# EAGLE schematic air_quality (EAGLE 6.5.0)
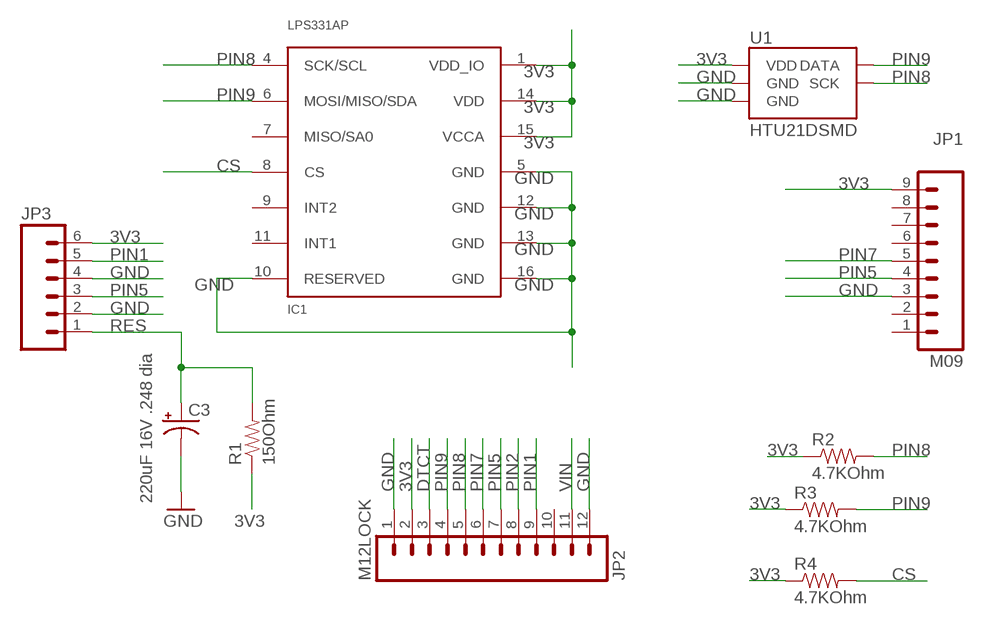
[diagram p0: schematic, sheet 1]

## Parts
C3  220uF 16V .248 dia  CPOL-US153CLV-0605  [153CLV-0605]
IC1  LPS331AP  [HCLGA-16L]
JP1  M09  [1X09]
JP2  M12LOCK  [1X12_LOCK]
JP3  M06LOCK  [1X06_LOCK]
R1  150Ohm  RESISTOR0402-RES  [0402-RES]
R2  4.7KOhm  RESISTOR0402-RES  [0402-RES]
R3  4.7KOhm  RESISTOR0402-RES  [0402-RES]
R4  4.7KOhm  RESISTOR0402-RES  [0402-RES]
U1  HTU21DSMD  [HTU21D]

## Nets
3V3: IC1.1(VDD_IO) IC1.14(VDD) IC1.15(VCCA) JP1.9 JP2.2 JP3.6 R1.1 R2.1 R3.1 R4.1 U1.VDD
CS: IC1.8(CS) R4.2
DTCT: JP2.3
GND: C3.- IC1.5(GND) IC1.10(RESERVED) IC1.12(GND) IC1.13(GND) IC1.16(GND) JP1.3 JP2.1 JP2.12 JP3.2 JP3.4 U1.7(GND) U1.GND
PIN1: JP2.9 JP3.5
PIN2: JP2.8
PIN5: JP1.4 JP2.7 JP3.3
PIN7: JP1.5 JP2.6
PIN8: IC1.4(SCK/SCL) JP2.5 R2.2 U1.SCK
PIN9: IC1.6(MOSI/MISO/SDA) JP2.4 R3.2 U1.DATA
RES: C3.+ JP3.1 R1.2
VIN: JP2.11
Unconnected: IC1.7(MISO/SA0) IC1.9(INT2) IC1.11(INT1) JP1.1 JP1.2 JP1.6 JP1.7 JP1.8 JP2.10

## Library data of the parts
C3 = rcl:CPOL-US: POLARIZED CAPACITOR, American symbol
IC1 = LPS331AP:LPS331AP
JP1 = SparkFun-Connectors:M09: Header 9 Standard 9-pin 0.1" header. Use with straight break away headers (SKU : PRT-00116), right angle break away headers (PRT-00553), swiss pins (PRT-00743), machine pins (PRT-00117), and female headers (PRT-00115).
JP2 = SparkFun-Connectors:M12: Header 12 Standard 12-pin 0.1" header. Use with straight break away headers (SKU : PRT-00116), right angle break away headers (PRT-00553), swiss pins (PRT-00743), machine pins (PRT-00117), and female headers (PRT-00115).
JP3 = SparkFun-Connectors:M06: Header 6 Standard 6-pin 0.1" header. Use with straight break away headers (SKU : PRT-00116), right angle break away headers (PRT-00553), swiss pins (PRT-00743), machine pins (PRT-00117), and female headers (PRT-00115). Molex polarized connector foot print use with SKU : PRT-08094 with associated crimp pins and housings. NOTES ON THE VARIANTS LOCK and LOCK_LONGPADS... This footprint was designed to help hold the alignment of a through-hole component (i.e. 6-pin header) while soldering it into place. You may notice that each hole has been shifted either up or down by 0.005 of an inch from it's more standard position (which is a perfectly straight line). This slight alteration caused the pins (the squares in the middle) to touch the edges of the holes. Because they are alternating, it causes a "brace" to hold the component in place. 0.005 has proven to be the perfect amount of "off-center" position when using our standard breakaway headers. Although looks a little odd when you look at the bare footprint, once you have a header in there, the alteration is very hard to notice. Also,if you push a header all the way into place, it is covered up entirely on the bottom side. This idea of altering the position of holes to aid alignment will be further integrated into the Sparkfun Library for other footprints. It can help hold any component with 3 or more connection pins.
R1-R4 = SparkFun-Passives:RESISTOR: Resistor Basic schematic elements and footprints for 0603, 1206, and PTH resistors.
U1 = SparkFun-Sensors:HTU21D